# Altium schematic sheet rpi_shield.SchDoc
size A4
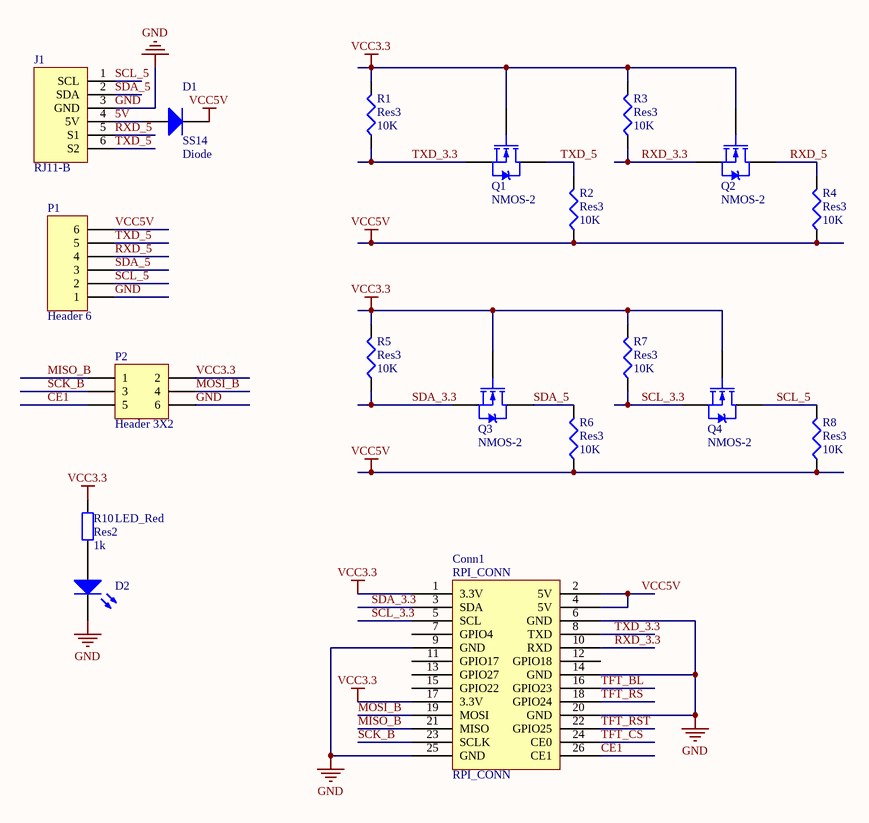
[diagram p0: rpi_shield.SchDoc]

## Parts
Conn1  RPI_CONN  [HDR2X13]
D1  Diode  value SS14  [DO-214]
D2  LED_Red  [D0603_B]
J1  RJ11-B  [PCB-606]
P1  Header 6  [HDR1X6]
P2  Header 3X2  [HDR2X3]
Q1  NMOS-2  [SOT-23-3]
Q2  NMOS-2  [SOT-23-3]
Q3  NMOS-2  [SOT-23-3]
Q4  NMOS-2  [SOT-23-3]
R1  Res3  value 10K  [J1-0603]
R2  Res3  value 10K  [J1-0603]
R3  Res3  value 10K  [J1-0603]
R4  Res3  value 10K  [J1-0603]
R5  Res3  value 10K  [J1-0603]
R6  Res3  value 10K  [J1-0603]
R7  Res3  value 10K  [J1-0603]
R8  Res3  value 10K  [J1-0603]
R10  Res2  value 1k  [R0603]

## Nets
GND: Conn1.6(GND) Conn1.9(GND) Conn1.14(GND) Conn1.20(GND) Conn1.25(GND) D2.2(K) J1.3(GND) P1.1 P2.6
VCC3.3: Conn1.1(3.3V) Conn1.17(3.3V) P2.2 Q1.1(G) Q2.1(G) Q3.1(G) Q4.1(G) R1.2 R3.2 R5.2 R7.2 R10.1
VCC5V: Conn1.2(5V) Conn1.4(5V) D1.2(K) P1.6 R2.1 R4.1 R6.1 R8.1
5V: D1.1(A) J1.4(5V)
CE1: Conn1.26(CE1) P2.5
MISO_B: Conn1.21(MISO) P2.1
MOSI_B: Conn1.19(MOSI) P2.4
RXD_3.3: Conn1.10(RXD) Q2.3(S) R3.1
RXD_5: J1.5(S1) P1.4 Q2.2(D) R4.2
SCK_B: Conn1.23(SCLK) P2.3
SCL_3.3: Conn1.5(SCL) Q4.3(S) R7.1
SCL_5: J1.1(SCL) P1.2 Q4.2(D) R8.2
SDA_3.3: Conn1.3(SDA) Q3.3(S) R5.1
SDA_5: J1.2(SDA) P1.3 Q3.2(D) R6.2
TFT_BL: Conn1.16(GPIO23)
TFT_CS: Conn1.24(CE0)
TFT_RS: Conn1.18(GPIO24)
TFT_RST: Conn1.22(GPIO25)
TXD_3.3: Conn1.8(TXD) Q1.3(S) R1.1
TXD_5: J1.6(S2) P1.5 Q1.2(D) R2.2
NetD2_1: D2.1(A) R10.2

Not connected (* = marked no-connect by the designer): Conn1 7(GPIO4) 11(GPIO17) 12(GPIO18) 13(GPIO27) 15(GPIO22)

## Library data of the parts
D1 = Diode: Default Diode; Published: 8-Jun-2000; LatestRevisionDate: 17-Jul-2002; LatestRevisionNote: Re-released for DXP Platform.; PackageDocument: Sep-1996; PackageReference: SMC; Publisher: Altium Limited; Code_JEDEC: DO-214-AB
D2 = LED3: Typical BLUE SiC LED; Published: 8-Jun-2000; LatestRevisionDate: 17-Dec-2003; LatestRevisionNote: PCB Footprint replaced.; DatasheetVersion: 16-Apr-2002; PackageVersion: 16-Apr-2002; PackageReference: 3.5X2.8X1.9; Publisher: Altium Limited
P1 = Header 6: Header, 6-Pin; LatestRevisionDate: 17-Jul-2002; LatestRevisionNote: Re-released for DXP Platform.; Publisher: Altium Limited
P2 = Header 3X2: Header, 3-Pin, Dual row; LatestRevisionDate: 17-Jul-2002; LatestRevisionNote: Re-released for DXP Platform.; Publisher: Altium Limited
Q1-Q4 = NMOS-2: N-Channel Power MOSFET; pin to pad: 2>3 3>2; Note: Pin 2 is electrically connected to pin 4.; Published: 8-Jun-2000; LatestRevisionDate: 17-Jul-2002; LatestRevisionNote: Re-released for DXP Platform.; DatasheetVersion: PD-9.814; PackageVersion: Feb-1997; PackageReference: TO-220AB; Publisher: Altium Limited; PackageDescription: TO, Thru-Hole, Vertical, Heatsink Mounted; 3 In-Line Leads; Pitch 2.54 mm; ComponentLink1Description: Manufacturer Link; ComponentLink1URL: http://www.irf.com/
R1-R8 = Res3: Resistor; Published: 8-Jun-2000; LatestRevisionDate: 29-May-2009; LatestRevisionNote: IPC-7351 Footprint Added.; PackageReference: J1-0603; Publisher: Altium Limited; PackageDescription: Chip Resistor
R10 = Res2: Resistor; Published: 8-Jun-2000; LatestRevisionDate: 17-Jul-2002; LatestRevisionNote: Re-released for DXP Platform.; PackageReference: AXIAL-0.4; Publisher: Altium Limited